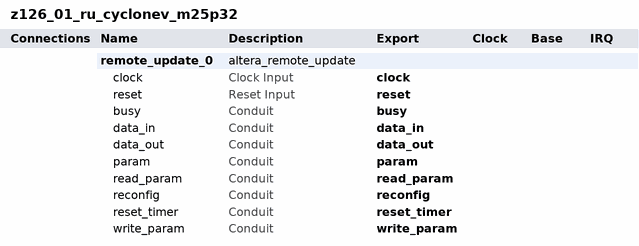
[diagram p0: system contents]
# Platform Designer (Qsys) system z126_01_ru_cyclonev_m25p32, Cyclone V 5CGXFC4C6F27I7
# Parameters at their usual value, and those the tool derives, are not listed.
package require -exact qsys 14.0
create_system z126_01_ru_cyclonev_m25p32
set_project_property DEVICE_FAMILY {Cyclone V}
set_project_property DEVICE 5CGXFC4C6F27I7

add_instance remote_update_0 altera_remote_update 14.0
set_instance_property remote_update_0 AUTO_EXPORT true
set_instance_parameter_value remote_update_0 CBX_AUTO_BLACKBOX ALL
set_instance_parameter_value remote_update_0 operation_mode REMOTE
set_instance_parameter_value remote_update_0 GUI_config_device EPCS64
set_instance_parameter_value remote_update_0 m_support_write_config_check true
set_instance_parameter_value remote_update_0 check_app_pof false

# exported interfaces
add_interface read_param conduit end
set_interface_property read_param EXPORT_OF remote_update_0.read_param
add_interface param conduit end
set_interface_property param EXPORT_OF remote_update_0.param
add_interface reconfig conduit end
set_interface_property reconfig EXPORT_OF remote_update_0.reconfig
add_interface reset_timer conduit end
set_interface_property reset_timer EXPORT_OF remote_update_0.reset_timer
add_interface clock clock sink
set_interface_property clock EXPORT_OF remote_update_0.clock
add_interface reset reset sink
set_interface_property reset EXPORT_OF remote_update_0.reset
add_interface busy conduit end
set_interface_property busy EXPORT_OF remote_update_0.busy
add_interface data_out conduit end
set_interface_property data_out EXPORT_OF remote_update_0.data_out
add_interface write_param conduit end
set_interface_property write_param EXPORT_OF remote_update_0.write_param
add_interface data_in conduit end
set_interface_property data_in EXPORT_OF remote_update_0.data_in

set_interconnect_requirement {$system} qsys_mm.clockCrossingAdapter HANDSHAKE
set_interconnect_requirement {$system} qsys_mm.maxAdditionalLatency 1
set_interconnect_requirement {$system} qsys_mm.insertDefaultSlave FALSE

save_system z126_01_ru_cyclonev_m25p32.qsys
